# Altium schematic sheet OpAmp.SchDoc
size A3; Author: Thomas Kreppel; CompanyName: TU München; DrawnBy: Thomas Kreppel; Engineer: Eyke Liegmann; Organization: TUM EAL; Address1: Arcisstraße 21; Address2: 80333 München; Address3: GERMANY; SheetNumber: 3; SheetTotal: 6; CompanyName2: EAL
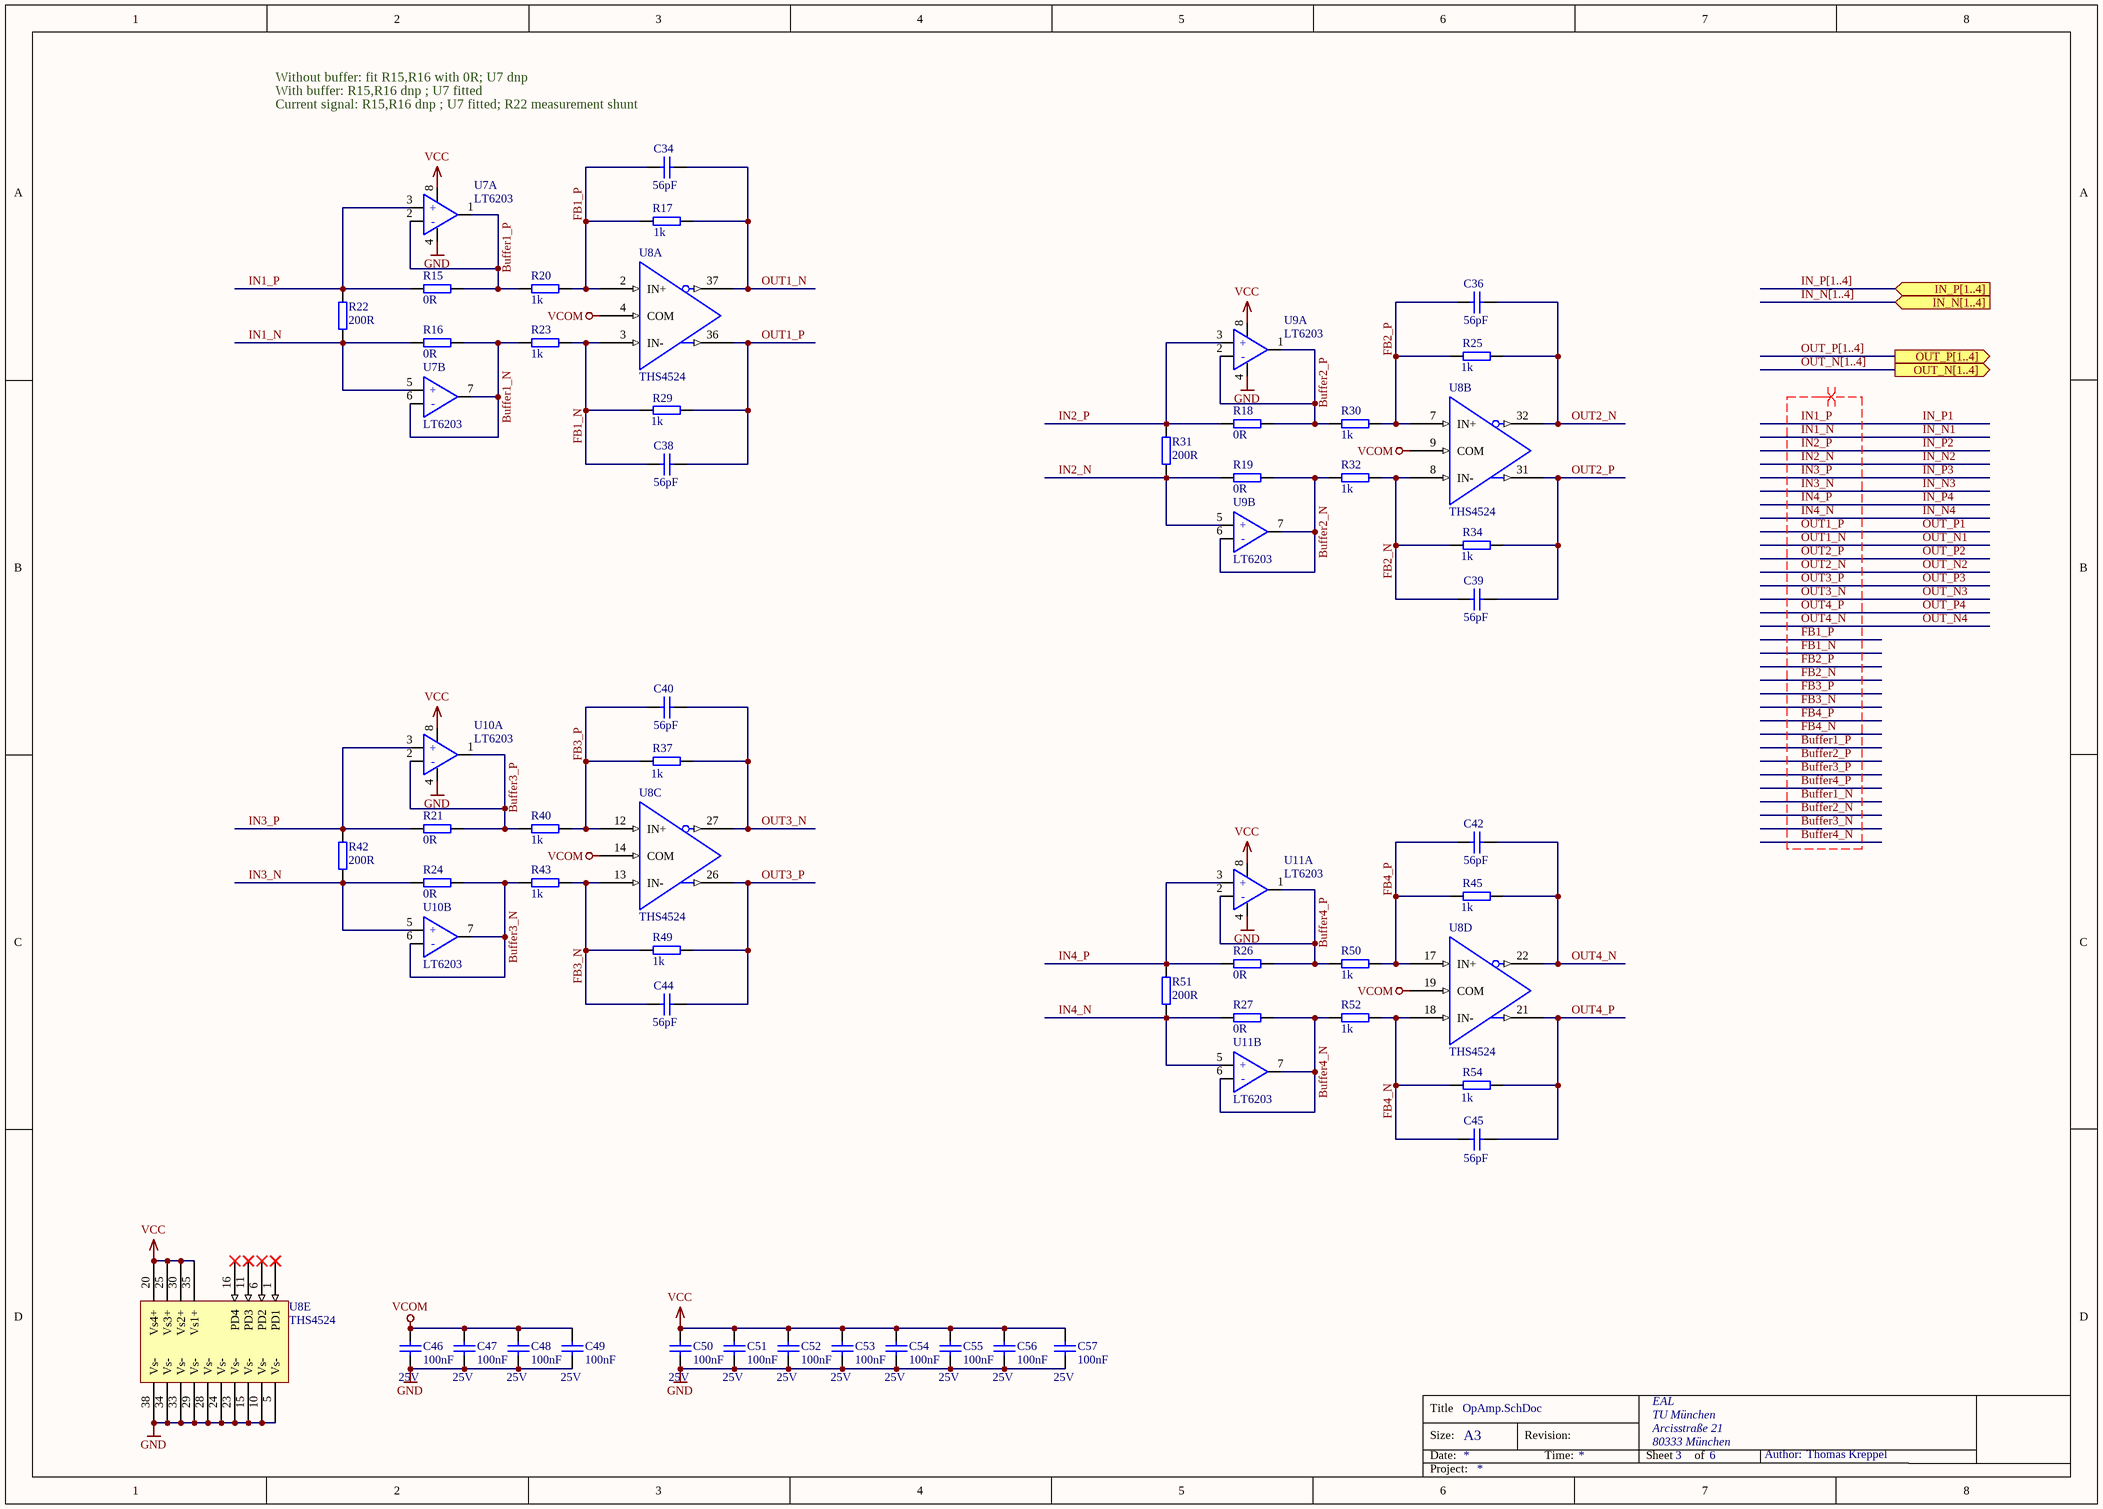
[diagram p0: OpAmp.SchDoc]

## Parts
C34  56pF  [CAPC1608X07N]
C36  56pF  [CAPC1608X07N]
C38  56pF  [CAPC1608X07N]
C39  56pF  [CAPC1608X07N]
C40  56pF  [CAPC1608X07N]
C42  56pF  [CAPC1608X07N]
C44  56pF  [CAPC1608X07N]
C45  56pF  [CAPC1608X07N]
C46  100nF  Voltage: 25V  [CAPC1608X07N]
C47  100nF  Voltage: 25V  [CAPC1608X07N]
C48  100nF  Voltage: 25V  [CAPC1608X07N]
C49  100nF  Voltage: 25V  [CAPC1608X07N]
C50  100nF  Voltage: 25V  [CAPC1608X07N]
C51  100nF  Voltage: 25V  [CAPC1608X07N]
C52  100nF  Voltage: 25V  [CAPC1608X07N]
C53  100nF  Voltage: 25V  [CAPC1608X07N]
C54  100nF  Voltage: 25V  [CAPC1608X07N]
C55  100nF  Voltage: 25V  [CAPC1608X07N]
C56  100nF  Voltage: 25V  [CAPC1608X07N]
C57  100nF  Voltage: 25V  [CAPC1608X07N]
R15  0R  [RESC1608X06N]
R16  0R  [RESC1608X06N]
R17  1k  [RESC1608X06N]
R18  0R  [RESC1608X06N]
R19  0R  [RESC1608X06N]
R20  1k  [RESC1608X06N]
R21  0R  [RESC1608X06N]
R22  200R  [RESC3216X65N]
R23  1k  [RESC1608X06N]
R24  0R  [RESC1608X06N]
R25  1k  [RESC1608X06N]
R26  0R  [RESC1608X06N]
R27  0R  [RESC1608X06N]
R29  1k  [RESC1608X06N]
R30  1k  [RESC1608X06N]
R31  200R  [RESC3216X65N]
R32  1k  [RESC1608X06N]
R34  1k  [RESC1608X06N]
R37  1k  [RESC1608X06N]
R40  1k  [RESC1608X06N]
R42  200R  [RESC3216X65N]
R43  1k  [RESC1608X06N]
R45  1k  [RESC1608X06N]
R49  1k  [RESC1608X06N]
R50  1k  [RESC1608X06N]
R51  200R  [RESC3216X65N]
R52  1k  [RESC1608X06N]
R54  1k  [RESC1608X06N]
U7  LT6203  [MSOP8_3x3-8N]  (parts A,B of 2)
U8  THS4524  [THS4524 Footprint]  (parts A,B,C,D,E of 5)
U9  LT6203  [MSOP8_3x3-8N]  (parts A,B of 2)
U10  LT6203  [MSOP8_3x3-8N]  (parts A,B of 2)
U11  LT6203  [MSOP8_3x3-8N]  (parts A,B of 2)

## Ports
IN_N[1..4] (in), IN_P[1..4] (in), OUT_N[1..4] (out), OUT_P[1..4] (out)

## Nets
GND: C46.2 C47.2 C48.2 C49.2 C50.2 C51.2 C52.2 C53.2 C54.2 C55.2 C56.2 C57.2 U7.4 U8.5(Vs-) U8.10(Vs-) U8.15(Vs-) U8.23(Vs-) U8.24(Vs-) U8.28(Vs-) U8.29(Vs-) U8.33(Vs-) U8.34(Vs-) U8.38(Vs-) U9.4 U10.4 U11.4
VCC: C50.1 C51.1 C52.1 C53.1 C54.1 C55.1 C56.1 C57.1 U7.8 U8.20(Vs4+) U8.25(Vs3+) U8.30(Vs2+) U8.35(Vs1+) U9.8 U10.8 U11.8
VCOM: C46.1 C47.1 C48.1 C49.1 U8.4(COM) U8.9(COM) U8.14(COM) U8.19(COM)
Buffer1_N: R16.2 R23.2 U7.6(-) U7.7
Buffer1_P: R15.2 R20.1 U7.1 U7.2(-)
Buffer2_N: R19.2 R32.2 U9.6(-) U9.7
Buffer2_P: R18.2 R30.1 U9.1 U9.2(-)
Buffer3_N: R24.2 R43.2 U10.6(-) U10.7
Buffer3_P: R21.2 R40.1 U10.1 U10.2(-)
Buffer4_N: R27.2 R52.2 U11.6(-) U11.7
Buffer4_P: R26.2 R50.1 U11.1 U11.2(-)
FB1_N: C38.1 R23.1 R29.1 U8.3(IN-)
FB1_P: C34.1 R17.1 R20.2 U8.2(IN+)
FB2_N: C39.1 R32.1 R34.1 U8.8(IN-)
FB2_P: C36.1 R25.1 R30.2 U8.7(IN+)
FB3_N: C44.1 R43.1 R49.1 U8.13(IN-)
FB3_P: C40.1 R37.1 R40.2 U8.12(IN+)
FB4_N: C45.1 R52.1 R54.1 U8.18(IN-)
FB4_P: C42.1 R45.1 R50.2 U8.17(IN+)
IN1_N: R16.1 R22.1 U7.5(+)  [also labelled IN_N1]
IN1_P: R15.1 R22.2 U7.3(+)  [also labelled IN_P1]
IN2_N: R19.1 R31.1 U9.5(+)  [also labelled IN_N2]
IN2_P: R18.1 R31.2 U9.3(+)  [also labelled IN_P2]
IN3_N: R24.1 R42.1 U10.5(+)  [also labelled IN_N3]
IN3_P: R21.1 R42.2 U10.3(+)  [also labelled IN_P3]
IN4_N: R27.1 R51.1 U11.5(+)  [also labelled IN_N4]
IN4_P: R26.1 R51.2 U11.3(+)  [also labelled IN_P4]
OUT1_N: C34.2 R17.2 U8.37(OUT-)  [also labelled OUT_N1]
OUT1_P: C38.2 R29.2 U8.36(OUT+)  [also labelled OUT_P1]
OUT2_N: C36.2 R25.2 U8.32(OUT-)  [also labelled OUT_N2]
OUT2_P: C39.2 R34.2 U8.31(OUT+)  [also labelled OUT_P2]
OUT3_N: C40.2 R37.2 U8.27(OUT-)  [also labelled OUT_N3]
OUT3_P: C44.2 R49.2 U8.26(OUT+)  [also labelled OUT_P3]
OUT4_N: C42.2 R45.2 U8.22(OUT-)  [also labelled OUT_N4]
OUT4_P: C45.2 R54.2 U8.21(OUT+)  [also labelled OUT_P4]

Not connected (* = marked no-connect by the designer): U8 1(PD1)* 6(PD2)* 11(PD3)* 16(PD4)*

## Buses and harness runs
bus IN_N[1..4] = port IN_N[1..4]
bus IN_P[1..4] = port IN_P[1..4]
bus OUT_N[1..4] = port OUT_N[1..4]
bus OUT_P[1..4] = port OUT_P[1..4]

## Layout directives
differential pair: Buffer1_N, Buffer1_P, Buffer2_N, Buffer2_P, Buffer3_N, Buffer3_P, Buffer4_N, Buffer4_P, FB1_N, FB1_P, FB2_N, FB2_P, FB3_N, FB3_P, FB4_N, FB4_P, IN1_N, IN1_P, IN2_N, IN2_P, IN3_N, IN3_P, IN4_N, IN4_P, OUT1_N, OUT1_P, OUT2_N, OUT2_P, OUT3_N, OUT3_P, OUT4_N, OUT4_P

## Notes on the sheet
- Without buffer: fit R15,R16 with 0R; U7 dnp
- With buffer: R15,R16 dnp ; U7 fitted
- Current signal: R15,R16 dnp ; U7 fitted; R22 measurement shunt
- Title
- Size:
- Date:
- A3
- Revision:
- Time:
- Sheet
- of
- Author:
- Project:

## Library data of the parts
C34 C36 C38-C40 C42 C44 C45 = Cap_0603: MPN: VJ0603A560JXACW1BC; MF: Vishay; Voltage: 50V; Dielectric: C0G; Value: 56pF; Supplier 1: Mouser; Supplier 2: *; Supplier Part Number 1: 77-VJ0603A560JXACBC; Supplier Part Number 2: *; Package: 0603
C46-C57 = Cap_0603: MPN: 885012206071; MF: Würth; Dielectric: X7R; Value: 100nF; Supplier 1: Mouser; Supplier 2: *; Supplier Part Number 1: 710-885012206071; Supplier Part Number 2: *; Package: 0603
R15 R16 R18 R19 R21 R24 R26 R27 = R_0603: MPN: CRCW06030000Z0EBC; MF: Vishay / Dale; Value: 0R; Supplier 1: Mouser; Supplier Part Number 1: 71-CRCW06030000Z0EBC; Package: 0603
R17 R20 R23 R25 R29 R30 R32 R34 R37 R40 R43 R45 R49 R50 R52 R54 = R_0603: MPN: CRCW06031K00JNEAC; MF: Vishay / Dale; Value: 1k; Supplier 1: Mouser; Supplier Part Number 1: 71-CRCW06031K00JNEAC; Package: 0603
R22 R31 R42 R51 = R_1206: WID SMD 1M 5% 0,25W; MPN: APC1206B200RN; AN: 22757; Mixed: SMT; Preferred: Yes; MF: AECOL/Ohmite; Case: 1206; Value: 200R; Technology: TK100; Created: 2018_07_20_AGeiger; Tolerance: 5%; Supplier 1: Mouser; Supplier Part Number 1: 284-APC1206B200RN
U7 U9-U11 = LT6203_MSOP8: 2 Ch Low Noise, Low Power OpAmp; MPN: LT6203CMS8#PBF; MF: Linear Technology; Created: Kreppel_20190830; Package: MSOP-8; Supplier 1: Mouser; Supplier Part Number 1: 584-LT6203CMS8#PBF
U8 = THS4524: Quad Channel fully differential Amplilfier; MF: Texas Instruments; Created: 20190720_Kreppel; MPN: THS4524; Package: TSSOP-38; Supplier 1: Mouser; Supplier Part Number 1: 595-THS4524IDBTR